# Altium schematic sheet Mako DSP Power R1.1.SchDoc
size A
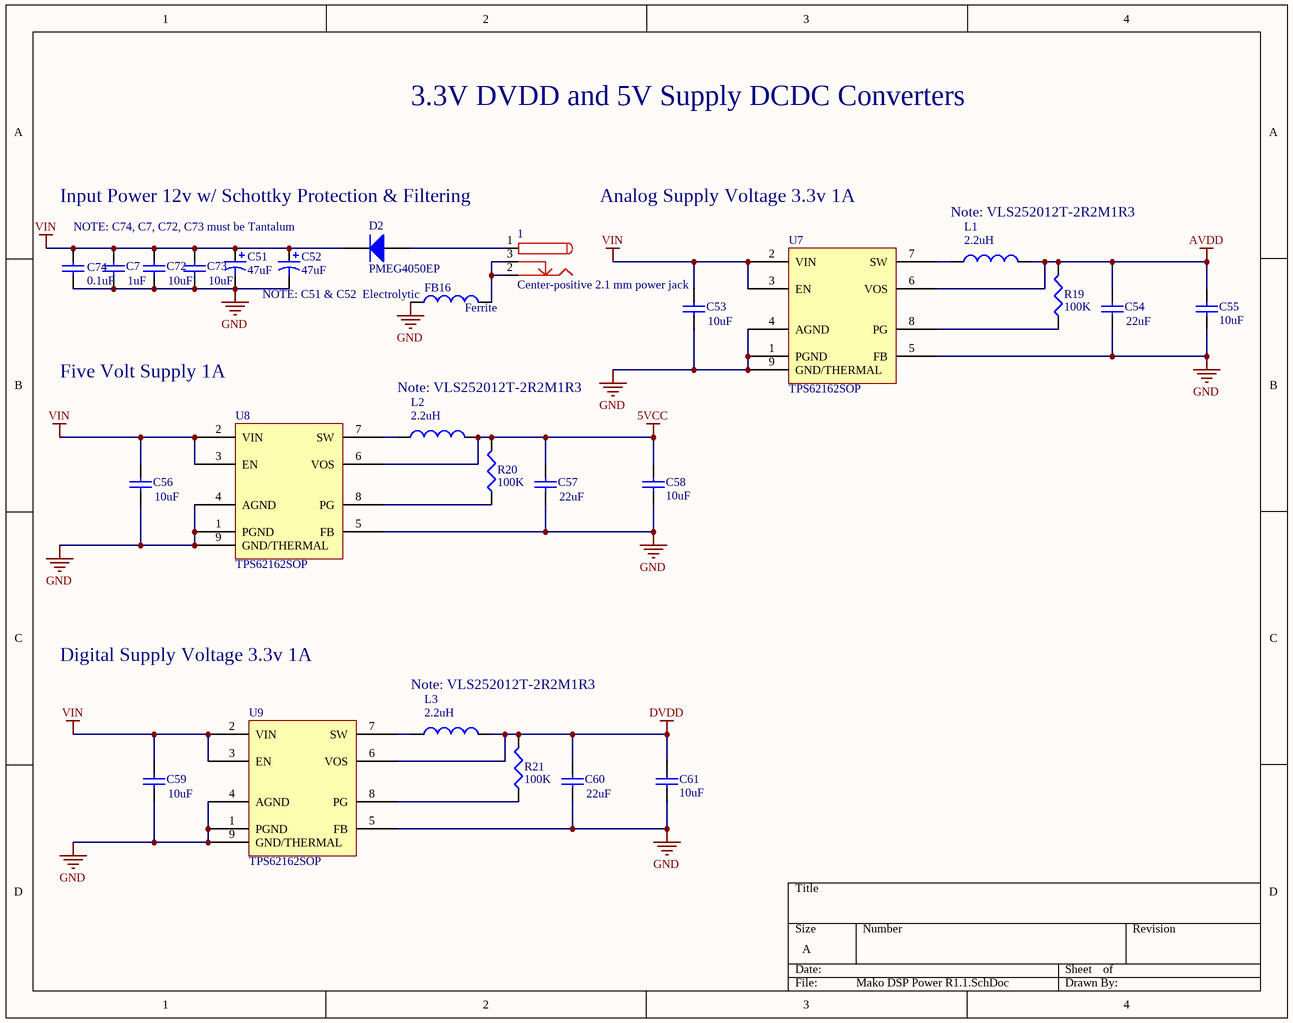
[diagram p0: Mako DSP Power R1.1.SchDoc]

## Parts
1  Center-positive 2.1 mm power jack  [PJ-102AH]
C7  value 1uF  [C1206]  (hidden comment: Cap Semi)
C51  value 47uF  [CAPPR2.5-6.3x5]  (hidden comment: Cap Pol1)
C52  value 47uF  [CAPPR2.5-6.3x5]  (hidden comment: Cap Pol1)
C53  value 10uF  [C1206]  (hidden comment: Cap Semi)
C54  value 22uF  [C1206]  (hidden comment: Cap Semi)
C55  value 10uF  [Panasonic VS B]  (hidden comment: Cap Semi)
C56  value 10uF  [C1206]  (hidden comment: Cap Semi)
C57  value 22uF  [C1206]  (hidden comment: Cap Semi)
C58  value 10uF  [Panasonic VS B]  (hidden comment: Cap Semi)
C59  value 10uF  [C1206]  (hidden comment: Cap Semi)
C60  value 22uF  [C1206]  (hidden comment: Cap Semi)
C61  value 10uF  [Panasonic VS B]  (hidden comment: Cap Semi)
C72  value 10uF  [C1206]  (hidden comment: Cap Semi)
C73  value 10uF  [C1206]  (hidden comment: Cap Semi)
C74  value 0.1uF  [C1206]  (hidden comment: Cap Semi)
D2  PMEG4050EP  [PMEG4050EP]
FB16  Ferrite  [SM 0805 - gap trimmed]
L1  value 2.2uH  [VLS252012T-2R2M1R3]  (hidden comment: Inductor)
L2  value 2.2uH  [VLS252012T-2R2M1R3]  (hidden comment: Inductor)
L3  value 2.2uH  [VLS252012T-2R2M1R3]  (hidden comment: Inductor)
R19  value 100K  [RESC2012L]  (hidden comment: Res3)
R20  value 100K  [RESC2012L]  (hidden comment: Res3)
R21  value 100K  [RESC2012L]  (hidden comment: Res3)
U7  TPS62162SOP  [TPS62162SOP]
U8  TPS62162SOP  [TPS62162SOP]
U9  TPS62162SOP  [TPS62162SOP]

## Nets
5VCC: C57.2 C58.1 L2.2 R20.2 U8.6(VOS)
AVDD: C54.2 C55.1 L1.2 R19.2 U7.6(VOS)
DVDD: C60.2 C61.1 L3.2 R21.2 U9.6(VOS)
GND: C7.1 C51.2 C52.2 C53.1 C54.1 C55.2 C56.1 C57.1 C58.2 C59.1 C60.1 C61.2 C72.1 C73.1 C74.1 FB16.1 U7.1(PGND) U7.4(AGND) U7.5(FB) U7.9(GND/THERMAL) U8.1(PGND) U8.4(AGND) U8.5(FB) U8.9(GND/THERMAL) U9.1(PGND) U9.4(AGND) U9.5(FB) U9.9(GND/THERMAL)
VIN: C7.2 C51.1 C52.1 C53.2 C56.2 C59.2 C72.2 C73.2 C74.2 D2.1(A) U7.2(VIN) U7.3(EN) U8.2(VIN) U8.3(EN) U9.2(VIN) U9.3(EN)
Net1_1: 1.1 D2.2(K)
Net1_2: 1.2 1.3 FB16.2
NetL1_1: L1.1 U7.7(SW)
NetL2_1: L2.1 U8.7(SW)
NetL3_1: L3.1 U9.7(SW)
NetR19_1: R19.1 U7.8(PG)
NetR20_1: R20.1 U8.8(PG)
NetR21_1: R21.1 U9.8(PG)

## Notes on the sheet
- 3.3V DVDD and 5V Supply DCDC Converters
- Input Power 12v w/ Schottky Protection & Filtering
- NOTE: C74, C7, C72, C73 must be Tantalum
- Analog Supply Voltage 3.3v 1A
- Note: VLS252012T-2R2M1R3
- (near FB16) NOTE: C51 & C52  Electrolytic
- Five Volt Supply 1A
- Digital Supply Voltage 3.3v 1A

## Library data of the parts
1 = PWR2.5: Power jack; Published: 17-Dec-2003; DatasheetDocument: 09-May-2002; Publisher: Altium Limited; ComponentLink1Description: Manufacturer Link; ComponentLink1URL: http://domino.kycon.com/internet/Products.html
C7 C53-C61 C72-C74 = Cap Semi: Capacitor (Semiconductor SIM Model); Published: 8-Jun-2000; LatestRevisionDate: 29-May-2009; LatestRevisionNote: IPC-7351 Footprint Added.; PackageReference: C1206; Publisher: Altium Limited; PackageDescription: Chip Capacitor
C51 C52 = Cap Pol1: Polarized Capacitor (Radial); Published: 8-Jun-2000; LatestRevisionDate: 17-Jul-2002; LatestRevisionNote: Re-released for DXP Platform.; PackageReference: RB7.6-15; Publisher: Altium Limited; PackageDescription: Polarized Capacitor (Radial); 2 Leads
D2 = Diode: Default Diode; Published: 8-Jun-2000; LatestRevisionDate: 17-Jul-2002; LatestRevisionNote: Re-released for DXP Platform.; PackageVersion: Sep-1996; PackageReference: SMC; Publisher: Altium Limited; PackageDescription: DO-214-AB/SMC; 2 C-Bend Leads; Body 7.9 x 5.9 mm, inc. leads (LxW); Code_JEDEC: DO-214-AB
FB16 L1-L3 = Inductor: Code_IEC: 1005; Published: 8-Jun-2000; PackageReference: 0402-A; Publisher: Altium Limited; Code_JEITA: 0402
  FB16: LatestRevisionDate: 17-Jul-2002; LatestRevisionNote: Re-released for DXP Platform.
  L1-L3: LatestRevisionDate: 29-May-2009; LatestRevisionNote: IPC-7351 Footprint Added.; PackageDescription: Chip Inductor
R19-R21 = Res3: Resistor; Published: 8-Jun-2000; LatestRevisionDate: 29-May-2009; LatestRevisionNote: IPC-7351 Footprint Added.; PackageReference: J1-0603; Publisher: Altium Limited; PackageDescription: Chip Resistor